# EAGLE design GPR_ADAPTER (EAGLE 9.6.2)
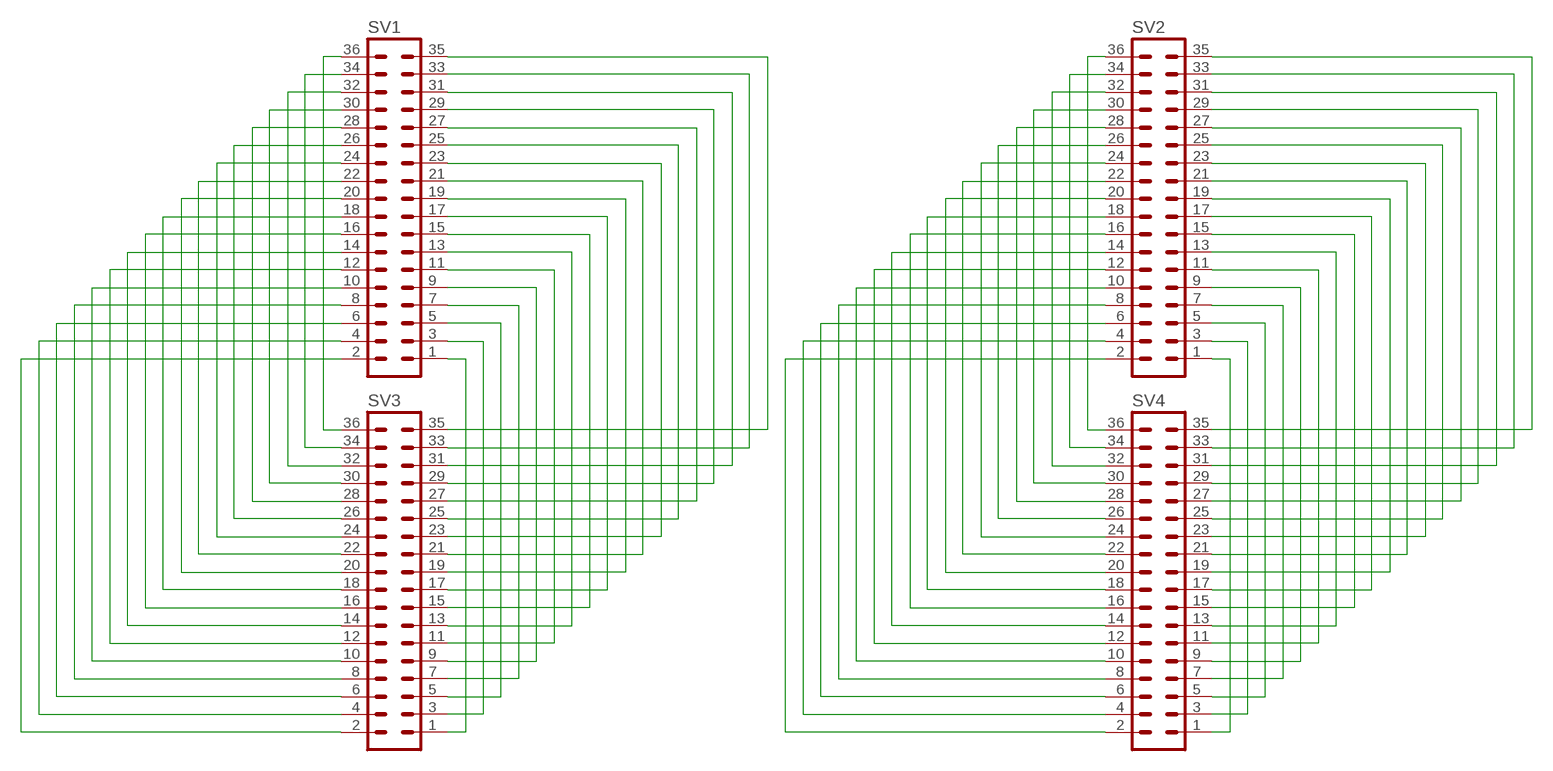
[diagram p0: schematic, sheet 1]

## Parts
SV1  MA18-2  [MA18-2]
SV2  MA18-2  [MA18-2]
SV3  MA18-2  [MA18-2]
SV4  MA18-2  [MA18-2]

## Nets
N$1: SV1.36 SV3.36
N$2: SV1.34 SV3.34
N$3: SV1.32 SV3.32
N$4: SV1.30 SV3.30
N$5: SV1.28 SV3.28
N$6: SV1.26 SV3.26
N$7: SV1.24 SV3.24
N$8: SV1.22 SV3.22
N$9: SV1.20 SV3.20
N$10: SV1.18 SV3.18
N$11: SV1.16 SV3.16
N$12: SV1.14 SV3.14
N$13: SV1.12 SV3.12
N$14: SV1.10 SV3.10
N$15: SV1.8 SV3.8
N$16: SV1.6 SV3.6
N$17: SV1.4 SV3.4
N$18: SV1.2 SV3.2
N$19: SV2.34 SV4.34
N$20: SV2.32 SV4.32
N$21: SV2.30 SV4.30
N$22: SV2.28 SV4.28
N$23: SV2.26 SV4.26
N$24: SV2.24 SV4.24
N$25: SV2.22 SV4.22
N$26: SV2.20 SV4.20
N$27: SV2.18 SV4.18
N$28: SV2.16 SV4.16
N$29: SV2.14 SV4.14
N$30: SV2.12 SV4.12
N$31: SV2.10 SV4.10
N$32: SV2.8 SV4.8
N$33: SV2.6 SV4.6
N$34: SV2.4 SV4.4
N$35: SV2.2 SV4.2
N$36: SV2.36 SV4.36
N$37: SV1.3 SV3.3
N$38: SV1.5 SV3.5
N$39: SV1.7 SV3.7
N$40: SV1.9 SV3.9
N$41: SV1.11 SV3.11
N$42: SV1.13 SV3.13
N$43: SV1.15 SV3.15
N$44: SV1.17 SV3.17
N$45: SV1.19 SV3.19
N$46: SV1.21 SV3.21
N$47: SV1.23 SV3.23
N$48: SV1.25 SV3.25
N$49: SV1.27 SV3.27
N$50: SV1.29 SV3.29
N$51: SV1.31 SV3.31
N$52: SV1.33 SV3.33
N$53: SV1.35 SV3.35
N$54: SV1.1 SV3.1
N$55: SV2.3 SV4.3
N$56: SV2.5 SV4.5
N$57: SV2.7 SV4.7
N$58: SV2.9 SV4.9
N$59: SV2.11 SV4.11
N$60: SV2.13 SV4.13
N$61: SV2.15 SV4.15
N$62: SV2.17 SV4.17
N$63: SV2.19 SV4.19
N$64: SV2.21 SV4.21
N$65: SV2.23 SV4.23
N$66: SV2.25 SV4.25
N$67: SV2.27 SV4.27
N$68: SV2.29 SV4.29
N$69: SV2.31 SV4.31
N$70: SV2.33 SV4.33
N$71: SV2.35 SV4.35
N$72: SV2.1 SV4.1

## Library data of the parts
SV1-SV4 = con-lstb:MA18-2: PIN HEADER; OC_FARNELL: unknown; OC_NEWARK: unknown

## Board
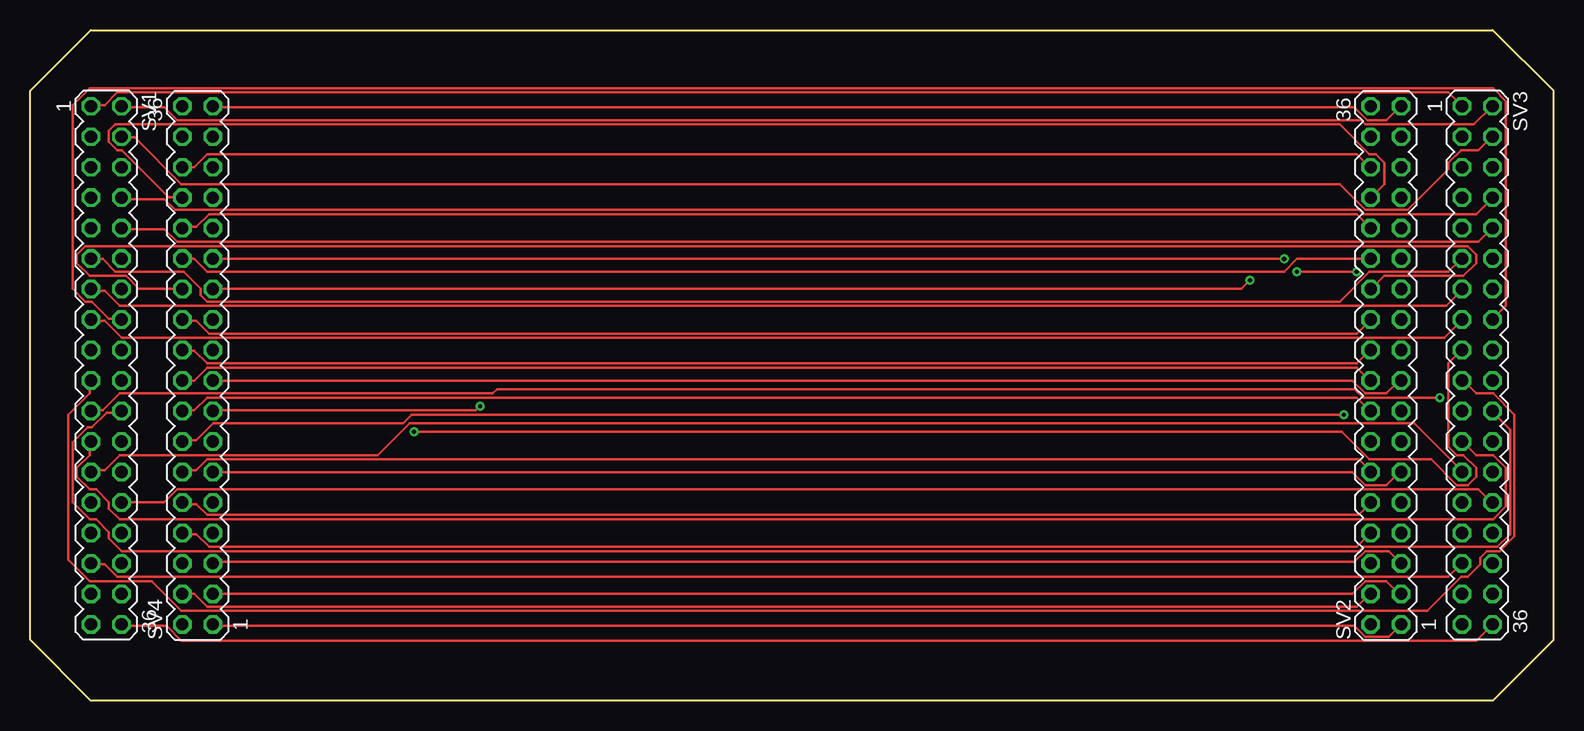
[diagram p1: board, top side]
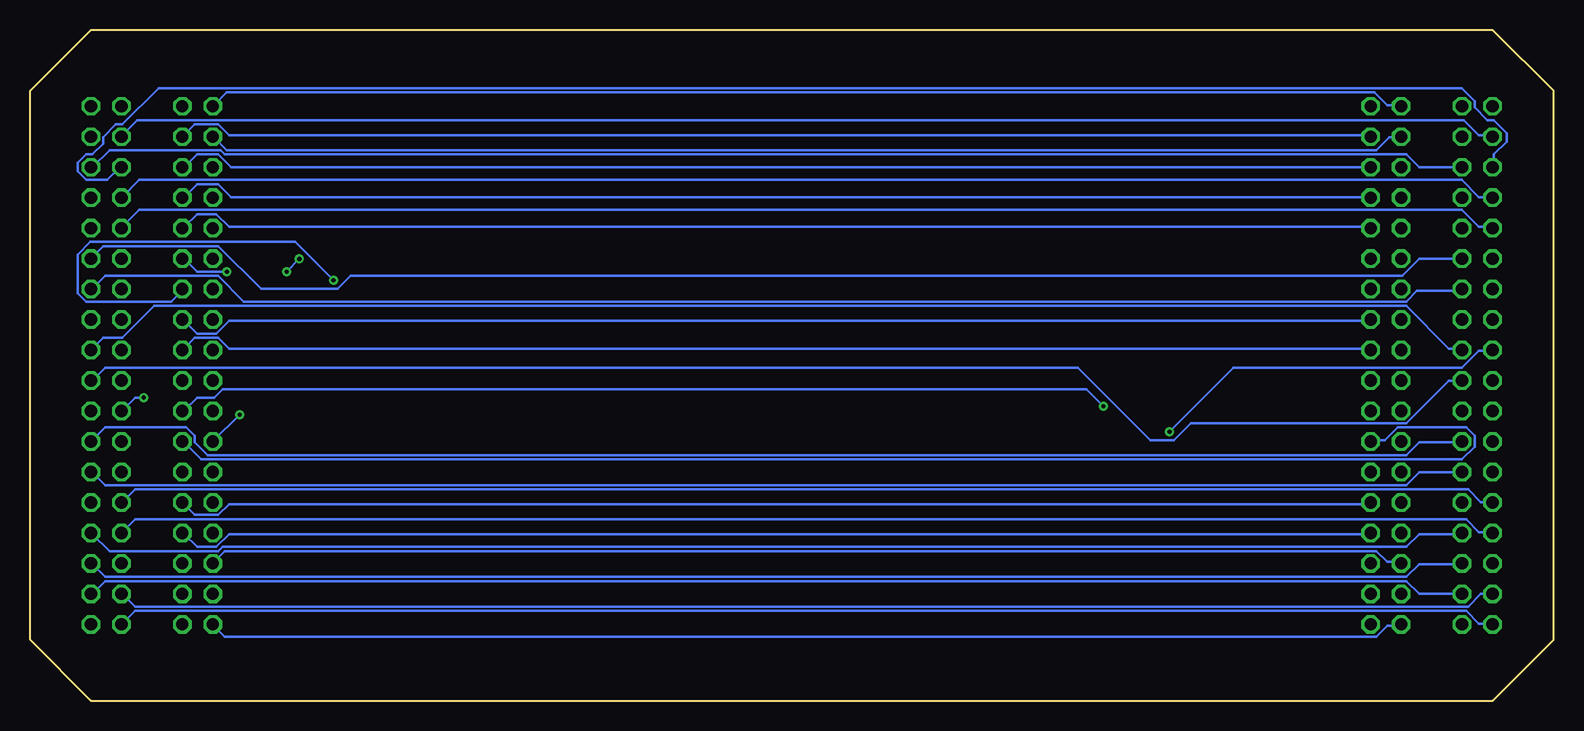
[diagram p2: board, bottom side, seen from below]

Size 127 x 55.88 mm. Coordinates in mm from the lower left corner, seen from the top.
Outline: 5.08,0 0,5.08 0,50.8 5.08,55.88 121.92,55.88 127,50.8 127,5.08 121.92,0 5.08,0
Copper layers (1*16): Top 0.035mm / dielectric 1.5mm / Bottom 0.035mm
Design rules "default *": minimum track width 8mil, minimum drill 0.35mm, track to track 6mil, track to pad 6mil, pad to pad 6mil, via to via 6mil, smd to smd 6mil, copper to edge 40mil, drill to drill 6mil, minimum pad ring 10mil, minimum via ring 8mil, stop-mask expansion 4mil, vias tented up to drill 0mil, thermal gap 10mil

### Footprints (pad centres in the part's own frame; a part is rotated, then mirrored left to right if it is on the bottom)
MA18-2 = drill 1.016 octagon: 1 -21.59,-1.27; 2 -21.59,1.27; 3 -19.05,-1.27; 4 -19.05,1.27; 5 -16.51,-1.27; 6 -16.51,1.27; 7 -13.97,-1.27; 8 -13.97,1.27; 9 -11.43,-1.27; 10 -11.43,1.27; 11 -8.89,-1.27; 12 -8.89,1.27; 13 -6.35,-1.27; 14 -6.35,1.27; 15 -3.81,-1.27; 16 -3.81,1.27; 17 -1.27,-1.27; 18 -1.27,1.27; 19 1.27,-1.27; 20 1.27,1.27; 21 3.81,-1.27; 22 3.81,1.27; 23 6.35,-1.27; 24 6.35,1.27; 25 8.89,-1.27; 26 8.89,1.27; 27 11.43,-1.27; 28 11.43,1.27; 29 13.97,-1.27; 30 13.97,1.27; 31 16.51,-1.27; 32 16.51,1.27; 33 19.05,-1.27; 34 19.05,1.27; 35 21.59,-1.27; 36 21.59,1.27

### Placement (x,y rotation side)
SV1  6.35,27.94 270 top
SV2  113.03,27.94 90 top
SV3  120.65,27.94 270 top
SV4  13.97,27.94 90 top

### Tracks (layer width: path | path; a pad name or v marks a point on that pad's centre or on a via)
N$1
  Top 0.203: SV3.36 120.55,4.98 12.62,4.98 11.38,6.22 7.64,6.22 SV1.36
N$2
  Bottom 0.203: SV1.34 11.2,8.89 12.27,9.96 120.73,9.96 121.79,8.89 SV3.34
N$3
  Bottom 0.203: SV1.32 7.64,11.38 11.2,11.38 12.27,10.31 120.73,10.31 121.79,11.38 SV3.32
N$4
  Bottom 0.203: SV1.30 7.64,13.87 11.2,13.87 12.27,12.8 110.95,12.8 111.3,12.45 120.37,12.45 121.79,13.87 SV3.30
N$5
  Top 0.203: SV1.28 7.64,16.54 11.2,16.54 12.27,17.6 120.73,17.6 121.79,16.54 SV3.28
N$6
  Bottom 0.203: SV1.26 7.64,19.02 11.2,19.02 12.27,17.96 120.73,17.96 121.79,19.02 SV3.26
N$7
  Bottom 0.203: SV1.24 7.64,21.51 11.2,21.51 12.27,20.45 112.19,20.45 113.26,21.51 113.26,22.05 113.97,22.76 120.73,22.76 121.79,21.69 SV3.24
N$8
  Top 0.203: SV1.22 7.47,24 6.4,24 5.16,22.76 4.8,22.76 3.56,21.51 3.56,16.54 4.98,15.11 5.51,15.11 6.58,14.05 6.58,13.51 7.64,12.45 110.77,12.45 111.12,12.8 122.33,12.8 123.39,13.87 123.39,22.58 121.97,24 SV3.22
N$9
  Bottom 0.203: SV1.20 8.71,26.67 12.27,23.11 30.23,23.11 31.65,21.69 33.6,21.69 39.65,27.74 120.73,27.74 121.79,26.67 SV3.20
N$10
  Bottom 0.203: SV3.18 120.9,30.23 119.3,30.23 116.64,32.89 12.27,32.89 8.71,29.34 7.64,29.34 SV1.18
N$11
  Top 0.203: SV1.16 7.47,31.83 6.58,31.83 5.16,33.25 4.62,33.25 3.56,34.31 3.56,49.61 4.98,51.03 121.97,51.03 123.04,49.96 123.04,32.89 121.97,31.83 SV3.16
N$12
  Bottom 0.203: SV1.14 7.64,34.14 11.38,34.14 12.27,33.25 109.17,33.25 111.3,35.38 120.73,35.38 121.79,34.31 SV3.14
N$13
  Bottom 0.203: SV1.12 7.64,36.8 11.2,36.8 12.62,35.38 100.28,35.38 101.35,34.31 107.75,34.31 111.3,37.87 120.9,37.87 121.79,36.98 SV3.12
N$14
  Top 0.203: SV1.10 7.64,39.29 11.2,39.29 12.27,38.23 120.73,38.23 121.79,39.29 SV3.10
N$15
  Top 0.203: SV3.8 120.55,40.54 111.12,40.54 110.77,40.89 12.09,40.89 11.2,41.78 7.64,41.78 SV1.8
N$16
  Bottom 0.203: SV1.6 11.2,44.45 12.27,45.52 110.77,45.52 111.12,45.87 120.37,45.87 121.79,44.45 SV3.6
N$17
  Top 0.203: SV1.4 7.64,46.94 8.71,46.94 12.62,43.03 109.17,43.03 111.3,40.89 114.86,40.89 118.24,44.27 118.24,44.81 119.3,45.87 120.73,45.87 121.79,46.94 SV3.4
N$18
  Top 0.203: SV1.2 7.64,49.43 11.2,49.43 12.27,48.36 110.95,48.36 111.3,48.01 120.37,48.01 121.79,49.43 SV3.2
N$19
  Bottom 0.203: SV4.34 12.8,46.94 13.69,46.94 14.76,45.87 110.59,45.87 111.66,46.94 SV2.34
N$20
  Top 0.203: SV4.32 13.69,44.45 14.76,45.52 110.59,45.52 111.66,44.45 SV2.32
N$21
  Top 0.203: SV4.30 12.62,41.96 11.56,41.96 7.64,45.87 7.29,45.87 6.58,46.58 6.58,47.47 7.11,48.01 109.17,48.01 111.66,45.52 112.19,45.52 112.9,44.81 112.9,43.03 111.84,41.96 SV2.30
N$22
  Top 0.203: SV2.28 110.59,40.54 14.94,40.54 13.87,39.47 12.8,39.47 SV4.28
N$23
  Top 0.203: SV4.26 12.8,36.8 13.69,36.8 14.76,35.74 104.55,35.74 105.61,36.8 111.66,36.8 SV2.26
N$24
  Top 0.203: SV4.24 12.62,34.31 9.07,34.31 8,35.38 4.98,35.38 3.91,36.45 3.91,37.16 4.62,37.87 119.84,37.87 120.55,37.16 120.55,36.45 119.48,35.38 112.9,35.38 111.84,34.31 SV2.24
N$25
  Top 0.203: SV2.22 110.59,30.58 14.94,30.58 13.87,31.65 12.8,31.65 SV4.22
N$26
  Top 0.203: SV4.20 12.8,29.16 13.69,29.16 14.76,28.09 110.59,28.09 111.66,29.16 SV2.20
N$27
  Top 0.203: SV4.18 13.69,26.67 14.76,27.74 110.59,27.74 111.66,26.67 SV2.18
N$28
  Top 0.203: SV4.16 12.8,24.18 13.69,24.18 14.76,25.25 110.59,25.25 111.66,24.18 SV2.16
N$29  (via drill 0.35)
  Top 0.203: v109.53,23.82 31.83,23.82 31.11,23.11 15.29,23.11 13.87,21.69 12.8,21.69 SV4.14
  Bottom 0.203: SV2.14 v109.53,23.82
N$30
  Top 0.203: SV4.12 12.8,19.2 13.87,19.2 14.76,20.09 110.77,20.09 111.66,19.2 SV2.12
N$31
  Top 0.203: SV4.10 12.8,16.36 13.87,16.36 14.76,15.47 110.77,15.47 111.66,16.36 SV2.10
N$32
  Top 0.203: SV2.8 110.59,12.8 14.94,12.8 13.87,13.87 12.8,13.87 SV4.8
N$33
  Bottom 0.203: SV4.6 12.8,11.56 13.87,11.56 14.76,12.45 110.77,12.45 111.66,11.56 SV2.6
N$34
  Top 0.203: SV4.4 13.69,8.89 14.76,7.82 110.59,7.82 111.66,8.89 SV2.4
N$35
  Bottom 0.203: SV4.2 12.8,6.22 13.87,6.22 14.76,5.33 110.77,5.33 111.66,6.22 SV2.2
N$36
  Bottom 0.203: SV4.36 12.8,49.61 13.87,49.61 14.94,50.67 110.59,50.67 111.66,49.61 SV2.36
N$37
  Bottom 0.203: SV1.3 5.16,47.12 6.22,47.12 7.47,48.36 118.06,48.36 119.3,47.12 SV3.3
N$38
  Bottom 0.203: SV1.5 4.98,44.45 4.98,45.52 3.91,46.58 3.91,47.3 4.98,48.36 5.51,48.36 6.58,49.43 6.58,49.96 7.64,51.03 116.28,51.03 119.3,48.01 119.84,48.01 120.9,46.94 120.9,46.41 121.79,45.52 122.33,45.52 123.04,44.81 123.04,44.09 122.33,43.38 120.55,43.38 119.48,44.45 SV3.5
N$39
  Bottom 0.203: SV1.7 5.16,41.96 6.22,41.96 7.64,43.38 117.88,43.38 119.3,41.96 SV3.7
N$40
  Bottom 0.203: SV1.9 5.16,39.47 6.22,39.47 7.64,40.89 117.88,40.89 119.3,39.47 SV3.9
N$41
  Top 0.203: SV1.11 5.16,36.8 6.04,36.8 7.11,35.74 12.8,35.74 14.22,34.31 14.22,33.78 14.76,33.25 109.17,33.25 111.66,35.74 118.24,35.74 119.3,36.8 SV3.11
N$42
  Top 0.203: SV1.13 5.16,34.14 6.22,34.14 7.47,32.89 118.06,32.89 119.3,34.14 SV3.13
N$43
  Top 0.203: SV1.15 5.16,31.65 6.22,31.65 7.64,30.23 117.88,30.23 119.3,31.65 SV3.15
N$44  (via drill 0.35)
  Top 0.203: v32,22.4 109.35,22.4 111.66,20.09 116.81,20.09 118.95,17.96 119.84,17.96 120.55,18.67 120.55,19.38 119.48,20.45 118.95,20.45 118.24,21.16 118.24,28.09 119.3,29.16 SV3.17
  Bottom 0.203: v32,22.4 26.67,27.74 7.64,27.74 6.22,29.16 5.16,29.16 SV1.17
N$45
  Top 0.203: SV1.19 4.98,26.67 4.98,25.6 3.2,23.82 3.2,11.73 4.98,9.96 10.13,9.96 12.62,7.47 116.46,7.47 119.3,10.31 119.84,10.31 120.9,11.38 120.9,11.91 121.44,12.45 122.5,12.45 123.75,13.69 123.75,23.82 121.97,25.6 120.55,25.6 119.48,26.67 SV3.19
N$46  (via drill 0.35)
  Top 0.203: v117.53,25.25 111.12,25.25 110.41,25.96 38.94,25.96 38.58,25.6 7.47,25.6 6.04,24.18 5.16,24.18 SV1.21
  Bottom 0.203: v117.53,25.25 118.24,25.25 119.3,24.18 SV3.21
N$47
  Top 0.203: SV1.23 4.98,21.51 4.98,20.45 3.91,19.38 3.91,18.67 4.98,17.6 5.51,17.6 6.58,16.54 6.58,16 7.47,15.11 121.97,15.11 123.04,16.18 123.04,19.38 121.97,20.45 120.55,20.45 119.48,21.51 SV3.23
N$48
  Top 0.203: SV1.25 5.16,19.2 6.22,19.2 7.47,20.45 28.98,20.45 31.65,23.11 115.39,23.11 119.3,19.2 SV3.25
N$49
  Bottom 0.203: SV1.27 5.16,16.54 6.04,16.54 7.11,17.6 118.24,17.6 119.3,16.54 SV3.27
N$50
  Bottom 0.203: SV3.29 118.24,15.11 7.29,15.11 6.22,14.05 5.16,14.05 SV1.29
N$51
  Top 0.203: SV1.31 5.16,11.38 6.22,11.38 7.29,10.31 118.24,10.31 119.3,11.38 SV3.31
N$52
  Bottom 0.203: SV1.33 6.04,8.89 7.11,7.82 118.24,7.82 119.3,8.89 SV3.33
N$53
  Bottom 0.203: SV1.35 5.16,6.4 6.22,6.4 7.29,7.47 118.24,7.47 119.3,6.4 SV3.35
N$54
  Top 0.203: SV3.1 118.24,50.67 7.29,50.67 6.22,49.61 5.16,49.61 SV1.1
N$55
  Top 0.203: SV4.3 110.24,8.89 111.3,9.96 113.08,9.96 114.15,8.89 SV2.3
N$56
  Top 0.203: SV4.5 15.29,11.56 110.41,11.56 111.3,12.45 113.26,12.45 114.15,11.56 SV2.5
N$57
  Bottom 0.203: SV4.7 15.29,13.87 110.41,13.87 111.48,12.8 113.08,12.8 114.15,13.87 SV2.7
N$58
  Bottom 0.203: SV2.9 113.26,15.47 111.3,15.47 110.41,16.36 15.29,16.36 SV4.9
N$59
  Top 0.203: SV4.11 15.29,19.02 110.24,19.02 111.3,17.96 113.08,17.96 114.15,19.02 SV2.11
N$60
  Bottom 0.203: SV4.13 15.11,21.69 14.05,21.69 12.98,22.76 7.29,22.76 6.58,22.05 6.58,21.16 7.64,20.09 112.72,20.09 114.15,21.51 SV2.13
N$61  (via drill 0.35)
  Top 0.203: v37.52,24.54 37.16,24.18 15.29,24.18 SV4.15
  Bottom 0.203: v37.52,24.54 38.94,25.96 110.95,25.96 111.66,25.25 113.08,25.25 114.15,24.18 SV2.15
N$62
  Top 0.203: SV4.17 110.24,26.67 111.3,25.6 113.08,25.6 114.15,26.67 SV2.17
N$63
  Bottom 0.203: SV4.19 15.29,29.34 110.41,29.34 111.3,30.23 113.26,30.23 114.15,29.34 SV2.19
N$64
  Bottom 0.203: SV4.21 15.29,31.65 110.41,31.65 111.48,30.58 113.08,30.58 114.15,31.65 SV2.21
N$65  (via drill 0.35)
  Top 0.203: v101.7,35.03 100.99,34.31 15.29,34.31 SV4.23
  Bottom 0.203: v101.7,35.03 104.9,38.23 121.97,38.23 123.04,37.16 123.04,33.96 122.33,33.25 115.21,33.25 114.33,34.14 SV2.23
N$66  (via drill 0.35)
  Top 0.203: v104.55,36.8 15.29,36.8 SV4.25 | v110.59,35.74 v105.61,35.74
  Bottom 0.203: v105.61,35.74 v104.55,36.8 | v110.59,35.74 113.08,35.74 114.15,36.8 SV2.25
N$67
  Bottom 0.203: SV4.27 15.29,39.47 110.41,39.47 111.48,40.54 113.08,40.54 114.15,39.47 SV2.27
N$68
  Bottom 0.203: SV4.29 15.29,41.96 110.24,41.96 111.3,43.03 113.08,43.03 114.15,41.96 SV2.29
N$69
  Bottom 0.203: SV4.31 110.24,44.45 111.3,45.52 113.08,45.52 114.15,44.45 SV2.31
N$70
  Bottom 0.203: SV4.33 15.29,47.12 110.41,47.12 111.3,48.01 113.26,48.01 114.15,47.12 SV2.33
N$71
  Top 0.203: SV4.35 15.29,49.43 110.41,49.43 111.48,48.36 113.08,48.36 114.15,49.43 SV2.35
N$72
  Top 0.203: SV4.1 15.29,6.22 110.41,6.22 111.3,5.33 113.26,5.33 114.15,6.22 SV2.1